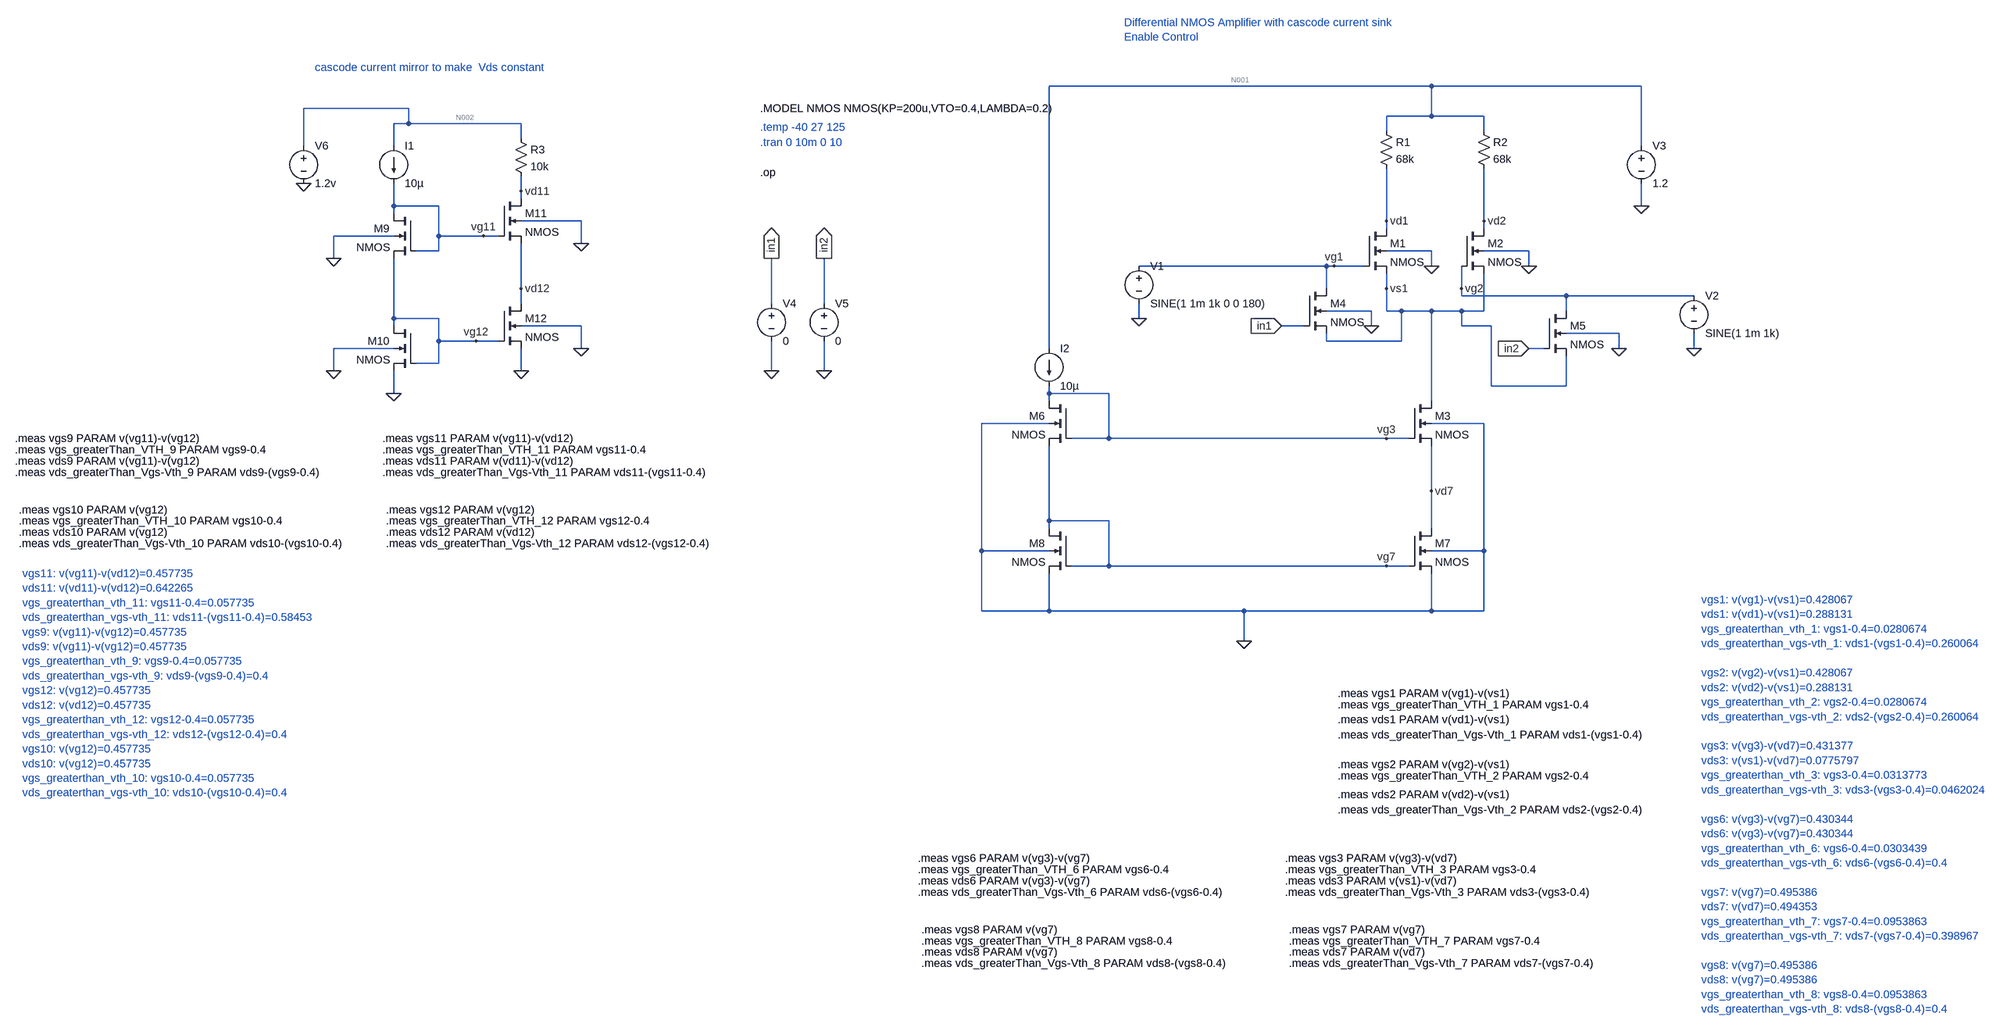
[diagram p0: schematic 5_differential_amplifier_v3_with_cascode_current_mirror.asc]
5_differential_amplifier_v3_with_cascode_current_mirror.asc, the LTspice schematic file:
Version 4
SHEET 1 2136 1360
WIRE 864 -720 48 -720
WIRE 1312 -720 864 -720
WIRE -1520 -672 -1744 -672
WIRE 864 -656 864 -720
WIRE 864 -656 768 -656
WIRE 976 -656 864 -656
WIRE -1520 -640 -1520 -672
WIRE -1520 -640 -1552 -640
WIRE -1280 -640 -1520 -640
WIRE 768 -624 768 -656
WIRE 976 -624 976 -656
WIRE -1280 -608 -1280 -640
WIRE -1744 -592 -1744 -672
WIRE -1552 -592 -1552 -640
WIRE 1312 -592 1312 -720
WIRE -1280 -496 -1280 -528
WIRE -1280 -480 -1280 -496
WIRE -1552 -464 -1552 -512
WIRE -1456 -464 -1552 -464
WIRE 1312 -464 1312 -512
WIRE -1552 -448 -1552 -464
WIRE -1152 -432 -1280 -432
WIRE 768 -432 768 -544
WIRE 976 -432 976 -544
WIRE 768 -416 768 -432
WIRE 976 -416 976 -432
WIRE -1552 -400 -1680 -400
WIRE -1456 -400 -1456 -464
WIRE -1360 -400 -1456 -400
WIRE -1328 -400 -1360 -400
WIRE -1152 -384 -1152 -432
WIRE -1456 -368 -1456 -400
WIRE -1456 -368 -1504 -368
WIRE 864 -368 768 -368
WIRE 1072 -368 976 -368
WIRE -1680 -352 -1680 -400
WIRE 640 -336 240 -336
WIRE 656 -336 640 -336
WIRE 720 -336 656 -336
WIRE 864 -336 864 -368
WIRE 1072 -336 1072 -368
WIRE -1280 -288 -1280 -384
WIRE 640 -288 640 -336
WIRE 768 -288 768 -320
WIRE 928 -288 928 -336
WIRE 928 -272 928 -288
WIRE 1152 -272 928 -272
WIRE 1424 -272 1152 -272
WIRE -1280 -256 -1280 -288
WIRE -544 -256 -544 -352
WIRE -432 -256 -432 -352
WIRE 736 -240 640 -240
WIRE 768 -240 768 -288
WIRE 800 -240 768 -240
WIRE 864 -240 800 -240
WIRE 928 -240 864 -240
WIRE 976 -240 976 -320
WIRE 976 -240 928 -240
WIRE 1152 -240 1152 -272
WIRE -1552 -224 -1552 -352
WIRE -1456 -224 -1552 -224
WIRE 240 -224 240 -256
WIRE -1552 -208 -1552 -224
WIRE -1152 -208 -1280 -208
WIRE 592 -208 544 -208
WIRE 736 -208 736 -240
WIRE 928 -208 928 -240
WIRE 992 -208 928 -208
WIRE 1264 -192 1152 -192
WIRE -1456 -176 -1456 -224
WIRE -1376 -176 -1456 -176
WIRE -1328 -176 -1376 -176
WIRE 640 -176 640 -192
WIRE 800 -176 800 -240
WIRE 800 -176 640 -176
WIRE -1552 -160 -1680 -160
WIRE -1152 -160 -1152 -208
WIRE 48 -160 48 -720
WIRE 1104 -160 1072 -160
WIRE 1264 -160 1264 -192
WIRE 1424 -160 1424 -192
WIRE -1456 -128 -1456 -176
WIRE -1456 -128 -1504 -128
WIRE -1680 -112 -1680 -160
WIRE -1280 -112 -1280 -160
WIRE -544 -112 -544 -176
WIRE -432 -112 -432 -176
WIRE 992 -80 992 -208
WIRE 1152 -80 1152 -144
WIRE 1152 -80 992 -80
WIRE -1552 -64 -1552 -112
WIRE 48 -64 48 -80
WIRE 176 -64 48 -64
WIRE 48 -48 48 -64
WIRE 864 -48 864 -240
WIRE 48 0 -96 0
WIRE 976 0 864 0
WIRE 176 32 176 -64
WIRE 176 32 96 32
WIRE 768 32 176 32
WIRE 816 32 768 32
WIRE 864 144 864 48
WIRE 48 208 48 48
WIRE 176 208 48 208
WIRE 48 224 48 208
WIRE 864 224 864 144
WIRE -96 272 -96 0
WIRE 48 272 -96 272
WIRE 976 272 976 0
WIRE 976 272 864 272
WIRE 176 304 176 208
WIRE 176 304 96 304
WIRE 768 304 176 304
WIRE 816 304 768 304
WIRE -96 400 -96 272
WIRE 48 400 48 320
WIRE 48 400 -96 400
WIRE 464 400 48 400
WIRE 864 400 864 320
WIRE 864 400 464 400
WIRE 976 400 976 272
WIRE 976 400 864 400
WIRE 464 464 464 400
FLAG 240 -224 0
FLAG 864 -336 0
FLAG 1072 -336 0
FLAG 1424 -160 0
FLAG 1312 -464 0
FLAG 656 -336 vg1
FLAG 768 -288 vs1
FLAG 768 -432 vd1
FLAG 928 -288 vg2
FLAG 976 -432 vd2
FLAG 768 32 vg3
FLAG -544 -112 0
FLAG -432 -112 0
FLAG -544 -352 in1
IOPIN -544 -352 Out
FLAG -432 -352 in2
IOPIN -432 -352 Out
FLAG 1264 -160 0
FLAG 736 -208 0
FLAG 544 -208 in1
IOPIN 544 -208 In
FLAG 1072 -160 in2
IOPIN 1072 -160 In
FLAG 464 464 0
FLAG 768 304 vg7
FLAG 864 144 vd7
FLAG -1680 -352 0
FLAG -1552 -64 0
FLAG -1680 -112 0
FLAG -1152 -384 0
FLAG -1280 -112 0
FLAG -1152 -160 0
FLAG -1744 -512 0
FLAG -1360 -400 vg11
FLAG -1376 -176 vg12
FLAG -1280 -496 vd11
FLAG -1280 -288 vd12
DATAFLAG 48 128 ""
DATAFLAG 864 144 ""
DATAFLAG -1552 -304 ""
DATAFLAG -1280 -320 ""
DATAFLAG 864 -160 ""
DATAFLAG -1152 -416 ""
SYMBOL nmos4 720 -416 R0
SYMATTR InstName M1
SYMATTR Value2 l=1u w=60u
SYMBOL nmos4 928 -416 R0
SYMATTR InstName M2
SYMATTR Value2 l=1u w=60u
SYMBOL nmos4 816 -48 R0
SYMATTR InstName M3
SYMATTR Value2 l=1u w=100u
SYMBOL voltage 240 -352 R0
WINDOW 123 0 0 Left 0
WINDOW 39 0 0 Left 0
SYMATTR InstName V1
SYMATTR Value SINE(1 1m 1k 0 0 180)
SYMBOL voltage 1424 -288 R0
WINDOW 123 0 0 Left 0
WINDOW 39 0 0 Left 0
SYMATTR InstName V2
SYMATTR Value SINE(1 1m 1k)
SYMBOL voltage 1312 -608 R0
WINDOW 123 0 0 Left 0
WINDOW 39 0 0 Left 0
SYMATTR InstName V3
SYMATTR Value 1.2
SYMBOL res 752 -640 R0
SYMATTR InstName R1
SYMATTR Value 68k
SYMBOL res 960 -640 R0
SYMATTR InstName R2
SYMATTR Value 68k
SYMBOL voltage -544 -272 R0
WINDOW 123 0 0 Left 0
WINDOW 39 0 0 Left 0
SYMATTR InstName V4
SYMATTR Value 0
SYMBOL voltage -432 -272 R0
WINDOW 123 0 0 Left 0
WINDOW 39 0 0 Left 0
SYMATTR InstName V5
SYMATTR Value 0
SYMBOL nmos4 592 -288 R0
SYMATTR InstName M4
SYMATTR Value2 l=1u w=60u
SYMBOL nmos4 1104 -240 R0
SYMATTR InstName M5
SYMATTR Value2 l=1u w=60u
SYMBOL current 48 -160 R0
WINDOW 123 0 0 Left 0
WINDOW 39 0 0 Left 0
SYMATTR InstName I2
SYMATTR Value 10µ
SYMBOL nmos4 96 -48 M0
SYMATTR InstName M6
SYMATTR Value2 l=1u w=100u
SYMBOL nmos4 816 224 R0
SYMATTR InstName M7
SYMATTR Value2 l=1u w=10u
SYMBOL nmos4 96 224 M0
SYMATTR InstName M8
SYMATTR Value2 l=1u w=10u
SYMBOL current -1552 -592 R0
WINDOW 123 0 0 Left 0
WINDOW 39 0 0 Left 0
SYMATTR InstName I1
SYMATTR Value 10µ
SYMBOL res -1296 -624 R0
SYMATTR InstName R3
SYMATTR Value 10k
SYMBOL nmos4 -1504 -448 M0
SYMATTR InstName M9
SYMATTR Value2 l=1u w=30u
SYMBOL nmos4 -1504 -208 M0
SYMATTR InstName M10
SYMATTR Value2 l=1u w=30u
SYMBOL nmos4 -1328 -480 R0
SYMATTR InstName M11
SYMATTR Value2 l=1u w=30u
SYMBOL nmos4 -1328 -256 R0
SYMATTR InstName M12
SYMATTR Value2 l=1u w=30u
SYMBOL voltage -1744 -608 R0
WINDOW 123 0 0 Left 0
WINDOW 39 0 0 Left 0
SYMATTR InstName V6
SYMATTR Value 1.2v
TEXT 208 -856 Left 2 ;Differential NMOS Amplifier with cascode current sink\nEnable Control
TEXT -568 -672 Left 2 !.MODEL NMOS NMOS(KP=200u,VTO=0.4,LAMBDA=0.2)
TEXT -568 -600 Left 2 ;.tran 0 10m 0 10
TEXT -568 -536 Left 2 !.op
TEXT -568 -632 Left 2 ;.temp -40 27 125
TEXT -1720 -760 Left 2 ;cascode current mirror to make  Vds constant
TEXT 664 576 Left 2 !.meas vgs1 PARAM v(vg1)-v(vs1)
TEXT 664 632 Left 2 !.meas vds1 PARAM v(vd1)-v(vs1)
TEXT 664 600 Left 2 !.meas vgs_greaterThan_VTH_1 PARAM vgs1-0.4
TEXT 664 664 Left 2 !.meas vds_greaterThan_Vgs-Vth_1 PARAM vds1-(vgs1-0.4)
TEXT 664 728 Left 2 !.meas vgs2 PARAM v(vg2)-v(vs1)
TEXT 664 792 Left 2 !.meas vds2 PARAM v(vd2)-v(vs1)
TEXT 664 752 Left 2 !.meas vgs_greaterThan_VTH_2 PARAM vgs2-0.4
TEXT 664 824 Left 2 !.meas vds_greaterThan_Vgs-Vth_2 PARAM vds2-(vgs2-0.4)
TEXT 552 928 Left 2 !.meas vgs3 PARAM v(vg3)-v(vd7)
TEXT 552 976 Left 2 !.meas vds3 PARAM v(vs1)-v(vd7)
TEXT 552 952 Left 2 !.meas vgs_greaterThan_VTH_3 PARAM vgs3-0.4
TEXT 552 1000 Left 2 !.meas vds_greaterThan_Vgs-Vth_3 PARAM vds3-(vgs3-0.4)
TEXT -232 928 Left 2 !.meas vgs6 PARAM v(vg3)-v(vg7)
TEXT -232 976 Left 2 !.meas vds6 PARAM v(vg3)-v(vg7)
TEXT -232 952 Left 2 !.meas vgs_greaterThan_VTH_6 PARAM vgs6-0.4
TEXT -232 1000 Left 2 !.meas vds_greaterThan_Vgs-Vth_6 PARAM vds6-(vgs6-0.4)
TEXT 560 1080 Left 2 !.meas vgs7 PARAM v(vg7)
TEXT 560 1128 Left 2 !.meas vds7 PARAM v(vd7)
TEXT 560 1104 Left 2 !.meas vgs_greaterThan_VTH_7 PARAM vgs7-0.4
TEXT 560 1152 Left 2 !.meas vds_greaterThan_Vgs-Vth_7 PARAM vds7-(vgs7-0.4)
TEXT -224 1080 Left 2 !.meas vgs8 PARAM v(vg7)
TEXT -224 1128 Left 2 !.meas vds8 PARAM v(vg7)
TEXT -224 1104 Left 2 !.meas vgs_greaterThan_VTH_8 PARAM vgs8-0.4
TEXT -224 1152 Left 2 !.meas vds_greaterThan_Vgs-Vth_8 PARAM vds8-(vgs8-0.4)
TEXT -1576 32 Left 2 !.meas vgs11 PARAM v(vg11)-v(vd12)
TEXT -1576 80 Left 2 !.meas vds11 PARAM v(vd11)-v(vd12)
TEXT -1576 56 Left 2 !.meas vgs_greaterThan_VTH_11 PARAM vgs11-0.4
TEXT -1576 104 Left 2 !.meas vds_greaterThan_Vgs-Vth_11 PARAM vds11-(vgs11-0.4)
TEXT -2360 32 Left 2 !.meas vgs9 PARAM v(vg11)-v(vg12)
TEXT -2360 80 Left 2 !.meas vds9 PARAM v(vg11)-v(vg12)
TEXT -2360 56 Left 2 !.meas vgs_greaterThan_VTH_9 PARAM vgs9-0.4
TEXT -2360 104 Left 2 !.meas vds_greaterThan_Vgs-Vth_9 PARAM vds9-(vgs9-0.4)
TEXT -1568 184 Left 2 !.meas vgs12 PARAM v(vg12)
TEXT -1568 232 Left 2 !.meas vds12 PARAM v(vd12)
TEXT -1568 208 Left 2 !.meas vgs_greaterThan_VTH_12 PARAM vgs12-0.4
TEXT -1568 256 Left 2 !.meas vds_greaterThan_Vgs-Vth_12 PARAM vds12-(vgs12-0.4)
TEXT -2352 184 Left 2 !.meas vgs10 PARAM v(vg12)
TEXT -2352 232 Left 2 !.meas vds10 PARAM v(vg12)
TEXT -2352 208 Left 2 !.meas vgs_greaterThan_VTH_10 PARAM vgs10-0.4
TEXT -2352 256 Left 2 !.meas vds_greaterThan_Vgs-Vth_10 PARAM vds10-(vgs10-0.4)
TEXT -2344 320 Left 2 ;vgs11: v(vg11)-v(vd12)=0.457735\nvds11: v(vd11)-v(vd12)=0.642265\nvgs_greaterthan_vth_11: vgs11-0.4=0.057735\nvds_greaterthan_vgs-vth_11: vds11-(vgs11-0.4)=0.58453\nvgs9: v(vg11)-v(vg12)=0.457735\nvds9: v(vg11)-v(vg12)=0.457735\nvgs_greaterthan_vth_9: vgs9-0.4=0.057735\nvds_greaterthan_vgs-vth_9: vds9-(vgs9-0.4)=0.4\nvgs12: v(vg12)=0.457735\nvds12: v(vd12)=0.457735\nvgs_greaterthan_vth_12: vgs12-0.4=0.057735\nvds_greaterthan_vgs-vth_12: vds12-(vgs12-0.4)=0.4\nvgs10: v(vg12)=0.457735\nvds10: v(vg12)=0.457735\nvgs_greaterthan_vth_10: vgs10-0.4=0.057735\nvds_greaterthan_vgs-vth_10: vds10-(vgs10-0.4)=0.4
TEXT 1440 376 Left 2 ;vgs1: v(vg1)-v(vs1)=0.428067\nvds1: v(vd1)-v(vs1)=0.288131\nvgs_greaterthan_vth_1: vgs1-0.4=0.0280674\nvds_greaterthan_vgs-vth_1: vds1-(vgs1-0.4)=0.260064\n \nvgs2: v(vg2)-v(vs1)=0.428067\nvds2: v(vd2)-v(vs1)=0.288131\nvgs_greaterthan_vth_2: vgs2-0.4=0.0280674\nvds_greaterthan_vgs-vth_2: vds2-(vgs2-0.4)=0.260064\n \nvgs3: v(vg3)-v(vd7)=0.431377\nvds3: v(vs1)-v(vd7)=0.0775797\nvgs_greaterthan_vth_3: vgs3-0.4=0.0313773\nvds_greaterthan_vgs-vth_3: vds3-(vgs3-0.4)=0.0462024\n \nvgs6: v(vg3)-v(vg7)=0.430344\nvds6: v(vg3)-v(vg7)=0.430344\nvgs_greaterthan_vth_6: vgs6-0.4=0.0303439\nvds_greaterthan_vgs-vth_6: vds6-(vgs6-0.4)=0.4\n \nvgs7: v(vg7)=0.495386\nvds7: v(vd7)=0.494353\nvgs_greaterthan_vth_7: vgs7-0.4=0.0953863\nvds_greaterthan_vgs-vth_7: vds7-(vgs7-0.4)=0.398967\n \nvgs8: v(vg7)=0.495386\nvds8: v(vg7)=0.495386\nvgs_greaterthan_vth_8: vgs8-0.4=0.0953863\nvds_greaterthan_vgs-vth_8: vds8-(vgs8-0.4)=0.4

The netlist it stands for:
* 5_differential_amplifier_v3_with_cascode_current_mirror.asc
M1 vd1 vg1 vs1 0 NMOS l=1u w=60u
M2 vd2 vg2 vs1 0 NMOS l=1u w=60u
M3 vs1 vg3 vd7 0 NMOS l=1u w=100u
V1 vg1 0 SINE(1 1m 1k 0 0 180)
V2 vg2 0 SINE(1 1m 1k)
V3 N001 0 1.2
R1 N001 vd1 68k
R2 N001 vd2 68k
V4 in1 0 0
V5 in2 0 0
M4 vg1 in1 vs1 0 NMOS l=1u w=60u
M5 vg2 in2 vs1 0 NMOS l=1u w=60u
I2 N001 vg3 10µ
M6 vg3 vg3 vg7 0 NMOS l=1u w=100u
M7 vd7 vg7 0 0 NMOS l=1u w=10u
M8 vg7 vg7 0 0 NMOS l=1u w=10u
I1 N002 vg11 10µ
R3 N002 vd11 10k
M9 vg11 vg11 vg12 0 NMOS l=1u w=30u
M10 vg12 vg12 0 0 NMOS l=1u w=30u
M11 vd11 vg11 vd12 0 NMOS l=1u w=30u
M12 vd12 vg12 0 0 NMOS l=1u w=30u
V6 N002 0 1.2v
.model NMOS NMOS
.model PMOS PMOS
.lib standard.mos
* Differential NMOS Amplifier with cascode current sink
* Enable Control
.MODEL NMOS NMOS(KP=200u,VTO=0.4,LAMBDA=0.2)
* .tran 0 10m 0 10
.op
* .temp -40 27 125
* cascode current mirror to make  Vds constant
.meas vgs1 PARAM v(vg1)-v(vs1)
.meas vds1 PARAM v(vd1)-v(vs1)
.meas vgs_greaterThan_VTH_1 PARAM vgs1-0.4
.meas vds_greaterThan_Vgs-Vth_1 PARAM vds1-(vgs1-0.4)
.meas vgs2 PARAM v(vg2)-v(vs1)
.meas vds2 PARAM v(vd2)-v(vs1)
.meas vgs_greaterThan_VTH_2 PARAM vgs2-0.4
.meas vds_greaterThan_Vgs-Vth_2 PARAM vds2-(vgs2-0.4)
.meas vgs3 PARAM v(vg3)-v(vd7)
.meas vds3 PARAM v(vs1)-v(vd7)
.meas vgs_greaterThan_VTH_3 PARAM vgs3-0.4
.meas vds_greaterThan_Vgs-Vth_3 PARAM vds3-(vgs3-0.4)
.meas vgs6 PARAM v(vg3)-v(vg7)
.meas vds6 PARAM v(vg3)-v(vg7)
.meas vgs_greaterThan_VTH_6 PARAM vgs6-0.4
.meas vds_greaterThan_Vgs-Vth_6 PARAM vds6-(vgs6-0.4)
.meas vgs7 PARAM v(vg7)
.meas vds7 PARAM v(vd7)
.meas vgs_greaterThan_VTH_7 PARAM vgs7-0.4
.meas vds_greaterThan_Vgs-Vth_7 PARAM vds7-(vgs7-0.4)
.meas vgs8 PARAM v(vg7)
.meas vds8 PARAM v(vg7)
.meas vgs_greaterThan_VTH_8 PARAM vgs8-0.4
.meas vds_greaterThan_Vgs-Vth_8 PARAM vds8-(vgs8-0.4)
.meas vgs11 PARAM v(vg11)-v(vd12)
.meas vds11 PARAM v(vd11)-v(vd12)
.meas vgs_greaterThan_VTH_11 PARAM vgs11-0.4
.meas vds_greaterThan_Vgs-Vth_11 PARAM vds11-(vgs11-0.4)
.meas vgs9 PARAM v(vg11)-v(vg12)
.meas vds9 PARAM v(vg11)-v(vg12)
.meas vgs_greaterThan_VTH_9 PARAM vgs9-0.4
.meas vds_greaterThan_Vgs-Vth_9 PARAM vds9-(vgs9-0.4)
.meas vgs12 PARAM v(vg12)
.meas vds12 PARAM v(vd12)
.meas vgs_greaterThan_VTH_12 PARAM vgs12-0.4
.meas vds_greaterThan_Vgs-Vth_12 PARAM vds12-(vgs12-0.4)
.meas vgs10 PARAM v(vg12)
.meas vds10 PARAM v(vg12)
.meas vgs_greaterThan_VTH_10 PARAM vgs10-0.4
.meas vds_greaterThan_Vgs-Vth_10 PARAM vds10-(vgs10-0.4)
* vgs11: v(vg11)-v(vd12)=0.457735
* vds11: v(vd11)-v(vd12)=0.642265
* vgs_greaterthan_vth_11: vgs11-0.4=0.057735
* vds_greaterthan_vgs-vth_11: vds11-(vgs11-0.4)=0.58453
* vgs9: v(vg11)-v(vg12)=0.457735
* vds9: v(vg11)-v(vg12)=0.457735
* vgs_greaterthan_vth_9: vgs9-0.4=0.057735
* vds_greaterthan_vgs-vth_9: vds9-(vgs9-0.4)=0.4
* vgs12: v(vg12)=0.457735
* vds12: v(vd12)=0.457735
* vgs_greaterthan_vth_12: vgs12-0.4=0.057735
* vds_greaterthan_vgs-vth_12: vds12-(vgs12-0.4)=0.4
* vgs10: v(vg12)=0.457735
* vds10: v(vg12)=0.457735
* vgs_greaterthan_vth_10: vgs10-0.4=0.057735
* vds_greaterthan_vgs-vth_10: vds10-(vgs10-0.4)=0.4
* vgs1: v(vg1)-v(vs1)=0.428067
* vds1: v(vd1)-v(vs1)=0.288131
* vgs_greaterthan_vth_1: vgs1-0.4=0.0280674
* vds_greaterthan_vgs-vth_1: vds1-(vgs1-0.4)=0.260064
* vgs2: v(vg2)-v(vs1)=0.428067
* vds2: v(vd2)-v(vs1)=0.288131
* vgs_greaterthan_vth_2: vgs2-0.4=0.0280674
* vds_greaterthan_vgs-vth_2: vds2-(vgs2-0.4)=0.260064
* vgs3: v(vg3)-v(vd7)=0.431377
* vds3: v(vs1)-v(vd7)=0.0775797
* vgs_greaterthan_vth_3: vgs3-0.4=0.0313773
* vds_greaterthan_vgs-vth_3: vds3-(vgs3-0.4)=0.0462024
* vgs6: v(vg3)-v(vg7)=0.430344
* vds6: v(vg3)-v(vg7)=0.430344
* vgs_greaterthan_vth_6: vgs6-0.4=0.0303439
* vds_greaterthan_vgs-vth_6: vds6-(vgs6-0.4)=0.4
* vgs7: v(vg7)=0.495386
* vds7: v(vd7)=0.494353
* vgs_greaterthan_vth_7: vgs7-0.4=0.0953863
* vds_greaterthan_vgs-vth_7: vds7-(vgs7-0.4)=0.398967
* vgs8: v(vg7)=0.495386
* vds8: v(vg7)=0.495386
* vgs_greaterthan_vth_8: vgs8-0.4=0.0953863
* vds_greaterthan_vgs-vth_8: vds8-(vgs8-0.4)=0.4
.backanno
.end

* Results of the author's LTspice run, read from the files saved beside the schematic
* Operating Point:
*   V(vd1) = 860.1 mV
*   V(vg1) = 1 V
*   V(vs1) = 571.9 mV
*   V(vd2) = 860.1 mV
*   V(vg2) = 1 V
*   V(vg3) = 925.7 mV
*   V(vd7) = 494.4 mV
*   V(n001) = 1.2 V
*   V(in1) = 0 V
*   V(in2) = 0 V
*   V(vg7) = 495.4 mV
*   V(n002) = 1.2 V
*   V(vg11) = 910.5 mV
*   V(vd11) = 1.1 V
*   V(vg12) = 455.3 mV
*   V(vd12) = 456.2 mV
*   Id(M12) = 10 µA
*   Ig(M12) = 0 A
*   Ib(M12) = -466.2 fA
*   Is(M12) = -10 µA
*   Id(M11) = 10 µA
*   Ig(M11) = 0 A
*   Ib(M11) = -1.576 pA
*   Is(M11) = -10 µA
*   Id(M10) = 10 µA
*   Ig(M10) = 0 A
*   Ib(M10) = -465.3 fA
*   Is(M10) = -10 µA
*   Id(M9) = 10 µA
*   Ig(M9) = 0 A
*   Ib(M9) = -1.386 pA
*   Is(M9) = -10 µA
*   Id(M8) = 10 µA
*   Ig(M8) = 0 A
*   Ib(M8) = -505.4 fA
*   Is(M8) = -10 µA
*   Id(M7) = 9.998 µA
*   Ig(M7) = 0 A
*   Ib(M7) = -504.4 fA
*   Is(M7) = -9.998 µA
*   Id(M6) = 10 µA
*   Ig(M6) = 0 A
*   Ib(M6) = -1.441 pA
*   Is(M6) = -10 µA
*   Id(M5) = 1.438 pA
*   Ig(M5) = 0 A
*   Ib(M5) = -1.592 pA
*   Is(M5) = 153.9 fA
*   Id(M4) = 1.438 pA
*   Ig(M4) = 0 A
*   Ib(M4) = -1.592 pA
*   Is(M4) = 153.9 fA
*   Id(M3) = 9.998 µA
*   Ig(M3) = 0 A
*   Ib(M3) = -1.086 pA
*   Is(M3) = -9.998 µA
*   Id(M2) = 4.999 µA
*   Ig(M2) = 0 A
*   Ib(M2) = -1.452 pA
*   Is(M2) = -4.999 µA
*   Id(M1) = 4.999 µA
*   Ig(M1) = 0 A
*   Ib(M1) = -1.452 pA
*   Is(M1) = -4.999 µA
*   I(I1) = 10 µA
*   I(I2) = 10 µA
*   I(R3) = 10 µA
*   I(R2) = 4.999 µA
*   I(R1) = 4.999 µA
*   I(V6) = -20 µA
*   I(V5) = 0 A
*   I(V4) = 0 A
*   I(V3) = -20 µA
*   I(V2) = -1.438 pA
*   I(V1) = -1.438 pA
* From the log:
*   Semiconductor Device Operating Points:
*                           --- MOSFET Transistors ---
*   Name:          m12         m11         m10         m9          m8
*   Model:        nmos        nmos        nmos        nmos        nmos
*   Id:          1.00e-05    1.00e-05    1.00e-05    1.00e-05    1.00e-05
*   Vgs:         4.55e-01    4.54e-01    4.55e-01    4.55e-01    4.95e-01
*   Vds:         4.56e-01    6.44e-01    4.55e-01    4.55e-01    4.95e-01
*   Vbs:         0.00e+00   -4.56e-01    0.00e+00   -4.55e-01    0.00e+00
*   Vth:         4.00e-01    4.00e-01    4.00e-01    4.00e-01    4.00e-01
*   Vdsat:       5.53e-02    5.43e-02    5.53e-02    5.53e-02    9.54e-02
*   Gm:          3.62e-04    3.68e-04    3.62e-04    3.62e-04    2.10e-04
*   Gds:         1.83e-06    1.77e-06    1.83e-06    1.83e-06    1.82e-06
*   Gmb:         0.00e+00    0.00e+00    0.00e+00    0.00e+00    0.00e+00
*   Cbd:         0.00e+00    0.00e+00    0.00e+00    0.00e+00    0.00e+00
*   Cbs:         0.00e+00    0.00e+00    0.00e+00    0.00e+00    0.00e+00
*   Cgsov:       0.00e+00    0.00e+00    0.00e+00    0.00e+00    0.00e+00
*   Cgdov:       0.00e+00    0.00e+00    0.00e+00    0.00e+00    0.00e+00
*   Cgbov:       0.00e+00    0.00e+00    0.00e+00    0.00e+00    0.00e+00
*   Cgs:         0.00e+00    0.00e+00    0.00e+00    0.00e+00    0.00e+00
*   Cgd:         0.00e+00    0.00e+00    0.00e+00    0.00e+00    0.00e+00
*   Cgb:         0.00e+00    0.00e+00    0.00e+00    0.00e+00    0.00e+00
*   Name:          m7          m6          m5          m4          m3
*   Model:        nmos        nmos        nmos        nmos        nmos
*   Id:          1.00e-05    1.00e-05    1.44e-12    1.44e-12    1.00e-05
*   Vgs:         4.95e-01    4.30e-01   -5.72e-01   -5.72e-01    4.31e-01
*   Vds:         4.94e-01    4.30e-01    4.28e-01    4.28e-01    7.76e-02
*   Vbs:         0.00e+00   -4.95e-01   -5.72e-01   -5.72e-01   -4.94e-01
*   Vth:         4.00e-01    4.00e-01    4.00e-01    4.00e-01    4.00e-01
*   Vdsat:       9.54e-02    3.03e-02    0.00e+00    0.00e+00    3.14e-02
*   Gm:          2.10e-04    6.59e-04    0.00e+00    0.00e+00    6.37e-04
*   Gds:         1.82e-06    1.84e-06    0.00e+00    0.00e+00    1.97e-06
*   Gmb:         0.00e+00    0.00e+00    0.00e+00    0.00e+00    0.00e+00
*   Cbd:         0.00e+00    0.00e+00    0.00e+00    0.00e+00    0.00e+00
*   Cbs:         0.00e+00    0.00e+00    0.00e+00    0.00e+00    0.00e+00
*   Cgsov:       0.00e+00    0.00e+00    0.00e+00    0.00e+00    0.00e+00
*   Cgdov:       0.00e+00    0.00e+00    0.00e+00    0.00e+00    0.00e+00
*   Cgbov:       0.00e+00    0.00e+00    0.00e+00    0.00e+00    0.00e+00
*   Cgs:         0.00e+00    0.00e+00    0.00e+00    0.00e+00    0.00e+00
*   Cgd:         0.00e+00    0.00e+00    0.00e+00    0.00e+00    0.00e+00
*   Cgb:         0.00e+00    0.00e+00    0.00e+00    0.00e+00    0.00e+00
*   Name:          m2          m1
*   Model:        nmos        nmos
*   Id:          5.00e-06    5.00e-06
*   Vgs:         4.28e-01    4.28e-01
*   Vds:         2.88e-01    2.88e-01
*   Vbs:        -5.72e-01   -5.72e-01
*   Vth:         4.00e-01    4.00e-01
*   Vdsat:       2.81e-02    2.81e-02
*   Gm:          3.56e-04    3.56e-04
*   Gds:         9.45e-07    9.45e-07
*   Gmb:         0.00e+00    0.00e+00
*   Cbd:         0.00e+00    0.00e+00
*   Cbs:         0.00e+00    0.00e+00
*   Cgsov:       0.00e+00    0.00e+00
*   Cgdov:       0.00e+00    0.00e+00
*   Cgbov:       0.00e+00    0.00e+00
*   Cgs:         0.00e+00    0.00e+00
*   Cgd:         0.00e+00    0.00e+00
*   Cgb:         0.00e+00    0.00e+00
*   vgs1: v(vg1)-v(vs1)=0.428067
*   vds1: v(vd1)-v(vs1)=0.288131
*   vgs_greaterthan_vth_1: vgs1-0.4=0.0280674
*   vds_greaterthan_vgs-vth_1: vds1-(vgs1-0.4)=0.260064
*   vgs2: v(vg2)-v(vs1)=0.428067
*   vds2: v(vd2)-v(vs1)=0.288131
*   vgs_greaterthan_vth_2: vgs2-0.4=0.0280674
*   vds_greaterthan_vgs-vth_2: vds2-(vgs2-0.4)=0.260064
*   vgs3: v(vg3)-v(vd7)=0.431377
*   vds3: v(vs1)-v(vd7)=0.0775797
*   vgs_greaterthan_vth_3: vgs3-0.4=0.0313773
*   vds_greaterthan_vgs-vth_3: vds3-(vgs3-0.4)=0.0462024
*   vgs6: v(vg3)-v(vg7)=0.430344
*   vds6: v(vg3)-v(vg7)=0.430344
*   vgs_greaterthan_vth_6: vgs6-0.4=0.0303439
*   vds_greaterthan_vgs-vth_6: vds6-(vgs6-0.4)=0.4
*   vgs7: v(vg7)=0.495386
*   vds7: v(vd7)=0.494353
*   vgs_greaterthan_vth_7: vgs7-0.4=0.0953863
*   vds_greaterthan_vgs-vth_7: vds7-(vgs7-0.4)=0.398967
*   vgs8: v(vg7)=0.495386
*   vds8: v(vg7)=0.495386
*   vgs_greaterthan_vth_8: vgs8-0.4=0.0953863
*   vds_greaterthan_vgs-vth_8: vds8-(vgs8-0.4)=0.4
*   vgs11: v(vg11)-v(vd12)=0.454347
*   vds11: v(vd11)-v(vd12)=0.643783
*   vgs_greaterthan_vth_11: vgs11-0.4=0.0543471
*   vds_greaterthan_vgs-vth_11: vds11-(vgs11-0.4)=0.589436
*   vgs9: v(vg11)-v(vg12)=0.455273
*   vds9: v(vg11)-v(vg12)=0.455273
*   vgs_greaterthan_vth_9: vgs9-0.4=0.0552734
*   vds_greaterthan_vgs-vth_9: vds9-(vgs9-0.4)=0.4
*   vgs12: v(vg12)=0.455273
*   vds12: v(vd12)=0.4562
*   vgs_greaterthan_vth_12: vgs12-0.4=0.0552734
*   vds_greaterthan_vgs-vth_12: vds12-(vgs12-0.4)=0.400926
*   vgs10: v(vg12)=0.455273
*   vds10: v(vg12)=0.455273
*   vgs_greaterthan_vth_10: vgs10-0.4=0.0552734
*   vds_greaterthan_vgs-vth_10: vds10-(vgs10-0.4)=0.4